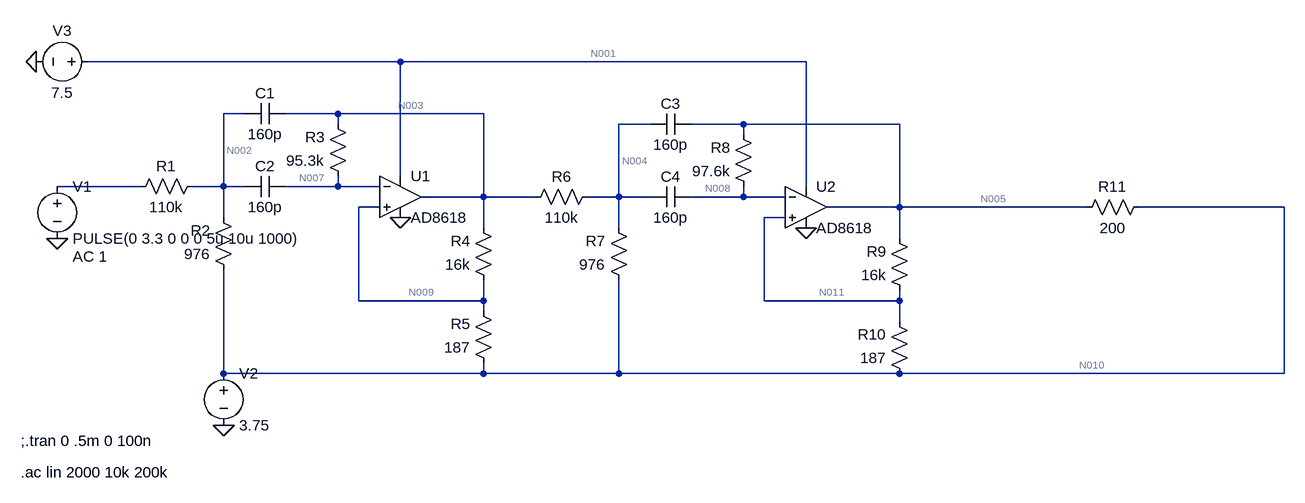
[diagram p0: schematic filter.asc]
filter.asc, the LTspice schematic file:
Version 4
SHEET 1 1940 680
WIRE 480 -48 0 -48
WIRE 1104 -48 480 -48
WIRE 240 32 208 32
WIRE 384 32 304 32
WIRE 608 32 384 32
WIRE 384 48 384 32
WIRE 864 48 816 48
WIRE 1008 48 928 48
WIRE 1248 48 1008 48
WIRE 1008 64 1008 48
WIRE 480 128 480 -48
WIRE 80 144 -48 144
WIRE 208 144 208 32
WIRE 208 144 160 144
WIRE 240 144 208 144
WIRE 384 144 384 128
WIRE 384 144 304 144
WIRE 448 144 384 144
WIRE 1104 144 1104 -48
WIRE 608 160 608 32
WIRE 608 160 512 160
WIRE 688 160 608 160
WIRE 816 160 816 48
WIRE 816 160 768 160
WIRE 864 160 816 160
WIRE 1008 160 1008 144
WIRE 1008 160 928 160
WIRE 1072 160 1008 160
WIRE 448 176 416 176
WIRE 1248 176 1248 48
WIRE 1248 176 1136 176
WIRE 1536 176 1248 176
WIRE 1840 176 1616 176
WIRE 208 192 208 144
WIRE 1072 192 1040 192
WIRE 608 208 608 160
WIRE 816 208 816 160
WIRE 1248 224 1248 176
WIRE 416 320 416 176
WIRE 608 320 608 288
WIRE 608 320 416 320
WIRE 1040 320 1040 192
WIRE 1248 320 1248 304
WIRE 1248 320 1040 320
WIRE 608 336 608 320
WIRE 1248 352 1248 320
WIRE 208 432 208 272
WIRE 608 432 608 416
WIRE 608 432 208 432
WIRE 816 432 816 288
WIRE 816 432 608 432
WIRE 1248 432 816 432
WIRE 1840 432 1840 176
WIRE 1840 432 1248 432
FLAG -80 -48 0
FLAG -48 224 0
FLAG 208 512 0
FLAG 480 192 0
FLAG 1104 208 0
SYMBOL res 176 128 R90
WINDOW 0 0 56 VBottom 2
WINDOW 3 32 56 VTop 2
SYMATTR InstName R1
SYMATTR Value 110k
SYMBOL res 224 288 R180
WINDOW 0 36 76 Left 2
WINDOW 3 36 40 Left 2
SYMATTR InstName R2
SYMATTR Value 976
SYMBOL res 400 144 R180
WINDOW 0 36 76 Left 2
WINDOW 3 36 40 Left 2
SYMATTR InstName R3
SYMATTR Value 95.3k
SYMBOL res 624 304 R180
WINDOW 0 36 76 Left 2
WINDOW 3 36 40 Left 2
SYMATTR InstName R4
SYMATTR Value 16k
SYMBOL res 624 432 R180
WINDOW 0 36 76 Left 2
WINDOW 3 36 40 Left 2
SYMATTR InstName R5
SYMATTR Value 187
SYMBOL res 784 144 R90
WINDOW 0 0 56 VBottom 2
WINDOW 3 32 56 VTop 2
SYMATTR InstName R6
SYMATTR Value 110k
SYMBOL res 832 304 R180
WINDOW 0 36 76 Left 2
WINDOW 3 36 40 Left 2
SYMATTR InstName R7
SYMATTR Value 976
SYMBOL res 1024 160 R180
WINDOW 0 36 76 Left 2
WINDOW 3 36 40 Left 2
SYMATTR InstName R8
SYMATTR Value 97.6k
SYMBOL res 1264 320 R180
WINDOW 0 36 76 Left 2
WINDOW 3 36 40 Left 2
SYMATTR InstName R9
SYMATTR Value 16k
SYMBOL res 1264 448 R180
WINDOW 0 36 76 Left 2
WINDOW 3 36 40 Left 2
SYMATTR InstName R10
SYMATTR Value 187
SYMBOL cap 304 16 R90
WINDOW 0 0 32 VBottom 2
WINDOW 3 32 32 VTop 2
SYMATTR InstName C1
SYMATTR Value 160p
SYMBOL cap 304 128 R90
WINDOW 0 0 32 VBottom 2
WINDOW 3 32 32 VTop 2
SYMATTR InstName C2
SYMATTR Value 160p
SYMBOL cap 928 32 R90
WINDOW 0 0 32 VBottom 2
WINDOW 3 32 32 VTop 2
SYMATTR InstName C3
SYMATTR Value 160p
SYMBOL cap 928 144 R90
WINDOW 0 0 32 VBottom 2
WINDOW 3 32 32 VTop 2
SYMATTR InstName C4
SYMATTR Value 160p
SYMBOL voltage -48 128 R0
WINDOW 123 24 124 Left 2
WINDOW 39 0 0 Left 0
SYMATTR Value2 AC 1
SYMATTR InstName V1
SYMATTR Value PULSE(0 3.3 0 0 0 5u 10u 1000)
SYMBOL voltage 208 416 R0
WINDOW 123 0 0 Left 0
WINDOW 39 0 0 Left 0
SYMATTR InstName V2
SYMATTR Value 3.75
SYMBOL voltage 16 -48 R90
WINDOW 0 -32 56 VBottom 2
WINDOW 3 32 56 VTop 2
WINDOW 123 0 0 Left 0
WINDOW 39 0 0 Left 0
SYMATTR InstName V3
SYMATTR Value 7.5
SYMBOL res 1632 160 R90
WINDOW 0 0 56 VBottom 2
WINDOW 3 32 56 VTop 2
SYMATTR InstName R11
SYMATTR Value 200
SYMBOL Opamps\\AD8618 480 96 R0
SYMATTR InstName U1
SYMBOL Opamps\\AD8618 1104 112 R0
SYMATTR InstName U2
TEXT -104 536 Left 2 !;.tran 0 .5m 0 100n
TEXT -104 584 Left 2 !.ac lin 2000 10k 200k

The netlist it stands for:
* filter.asc
R1 N002 N006 110k
R2 N010 N002 976
R3 N007 N003 95.3k
R4 N009 N003 16k
R5 N010 N009 187
R6 N004 N003 110k
R7 N010 N004 976
R8 N008 N005 97.6k
R9 N011 N005 16k
R10 N010 N011 187
C1 N003 N002 160p
C2 N007 N002 160p
C3 N005 N004 160p
C4 N008 N004 160p
V1 N006 0 PULSE(0 3.3 0 0 0 5u 10u 1000) AC 1
V2 N010 0 3.75
V3 N001 0 7.5
R11 N010 N005 200
XU1 N009 N007 N001 0 N003 AD8618  ; pins In+ In- V+ V- OUT
XU2 N011 N008 N001 0 N005 AD8618  ; pins In+ In- V+ V- OUT
;.tran 0 .5m 0 100n
.ac lin 2000 10k 200k
.backanno
.end

* Results of the author's LTspice run, read from the files saved beside the schematic
* Operating Point, zero values left out:
*   V(n002) = 3.717 V
*   V(n010) = 3.75 V
*   V(n007) = 3.751 V
*   V(n003) = 3.751 V
*   V(n009) = 3.75 V
*   V(n004) = 3.75 V
*   V(n008) = 3.751 V
*   V(n005) = 3.751 V
*   V(n011) = 3.75 V
*   V(n001) = 7.5 V
*   I(R11) = -6.548 µA
*   I(R10) = -80.91 nA
*   I(R9) = -80.91 nA
*   I(R7) = -11.8 nA
*   I(R6) = -11.8 nA
*   I(R5) = -80.91 nA
*   I(R4) = -80.91 nA
*   I(R2) = 33.79 µA
*   I(R1) = 33.79 µA
*   I(V3) = -4.627 mA
*   I(V2) = -27.07 µA
*   I(V1) = 33.79 µA
*   Ix(u1:99) = 2.312 mA
*   Ix(u1:50) = -2.312 mA
*   Ix(u1:45) = -92.71 nA
*   Ix(u2:99) = 2.315 mA
*   Ix(u2:50) = -2.308 mA
*   Ix(u2:45) = -6.629 µA